# Altium schematic sheet 08_MCU.SchDoc
size 420 x 297 mm; SheetNumber: 16; SheetTotal: 24
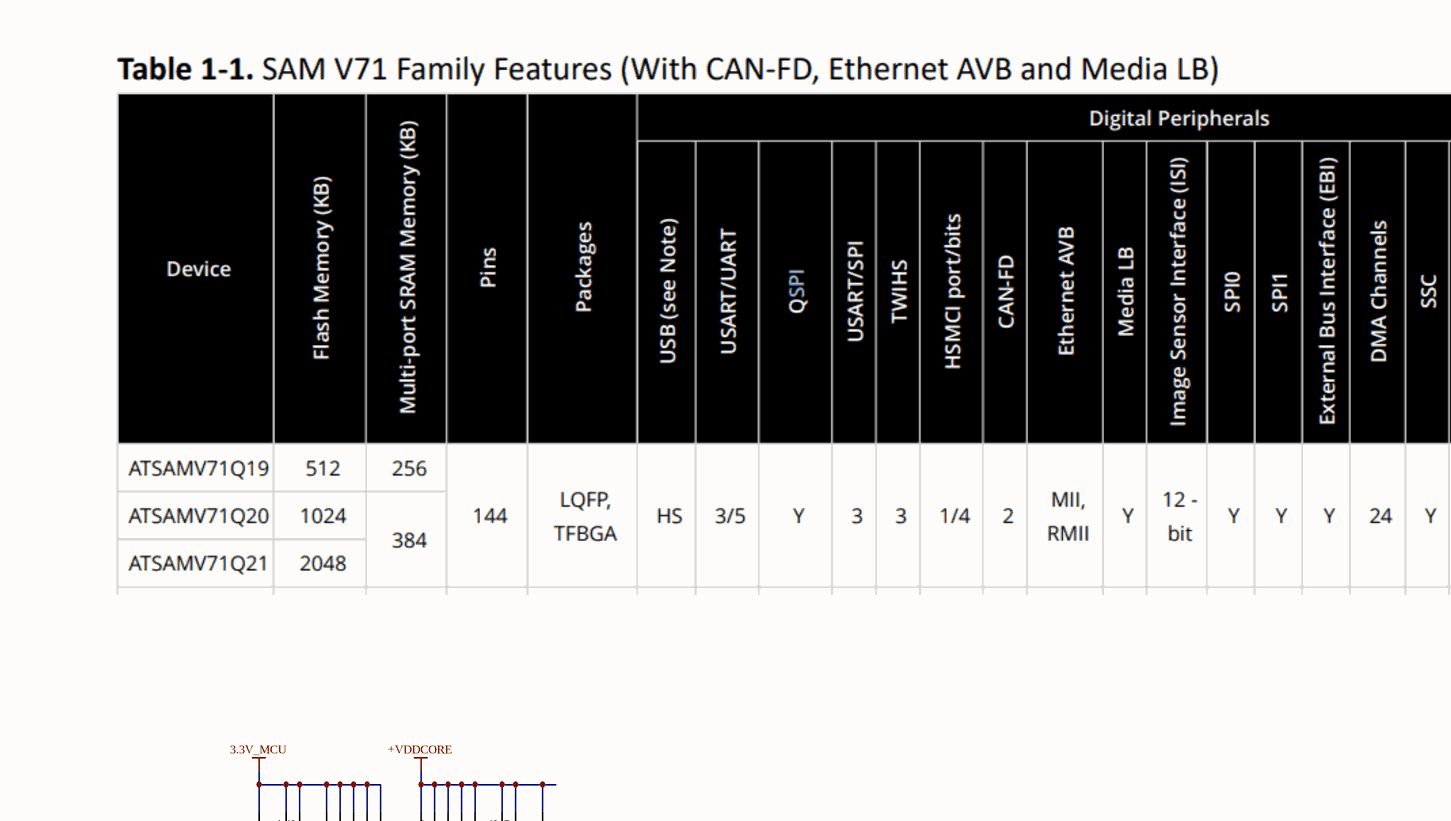
[diagram p0: 08_MCU.SchDoc, top left]
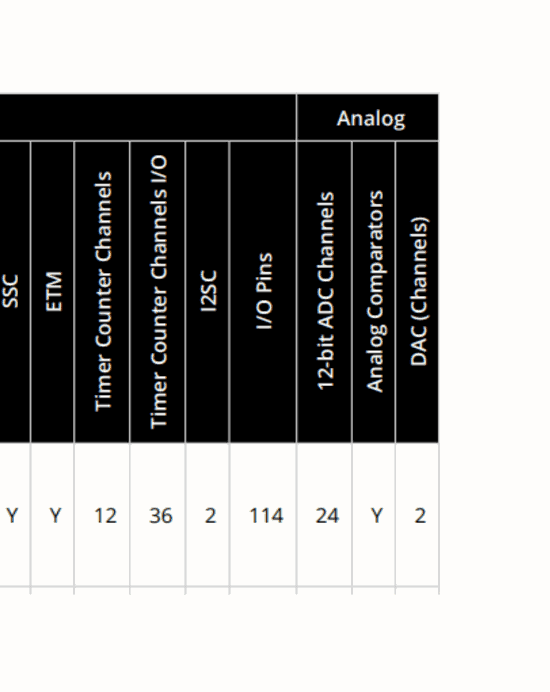
[diagram p1: 08_MCU.SchDoc, top right]
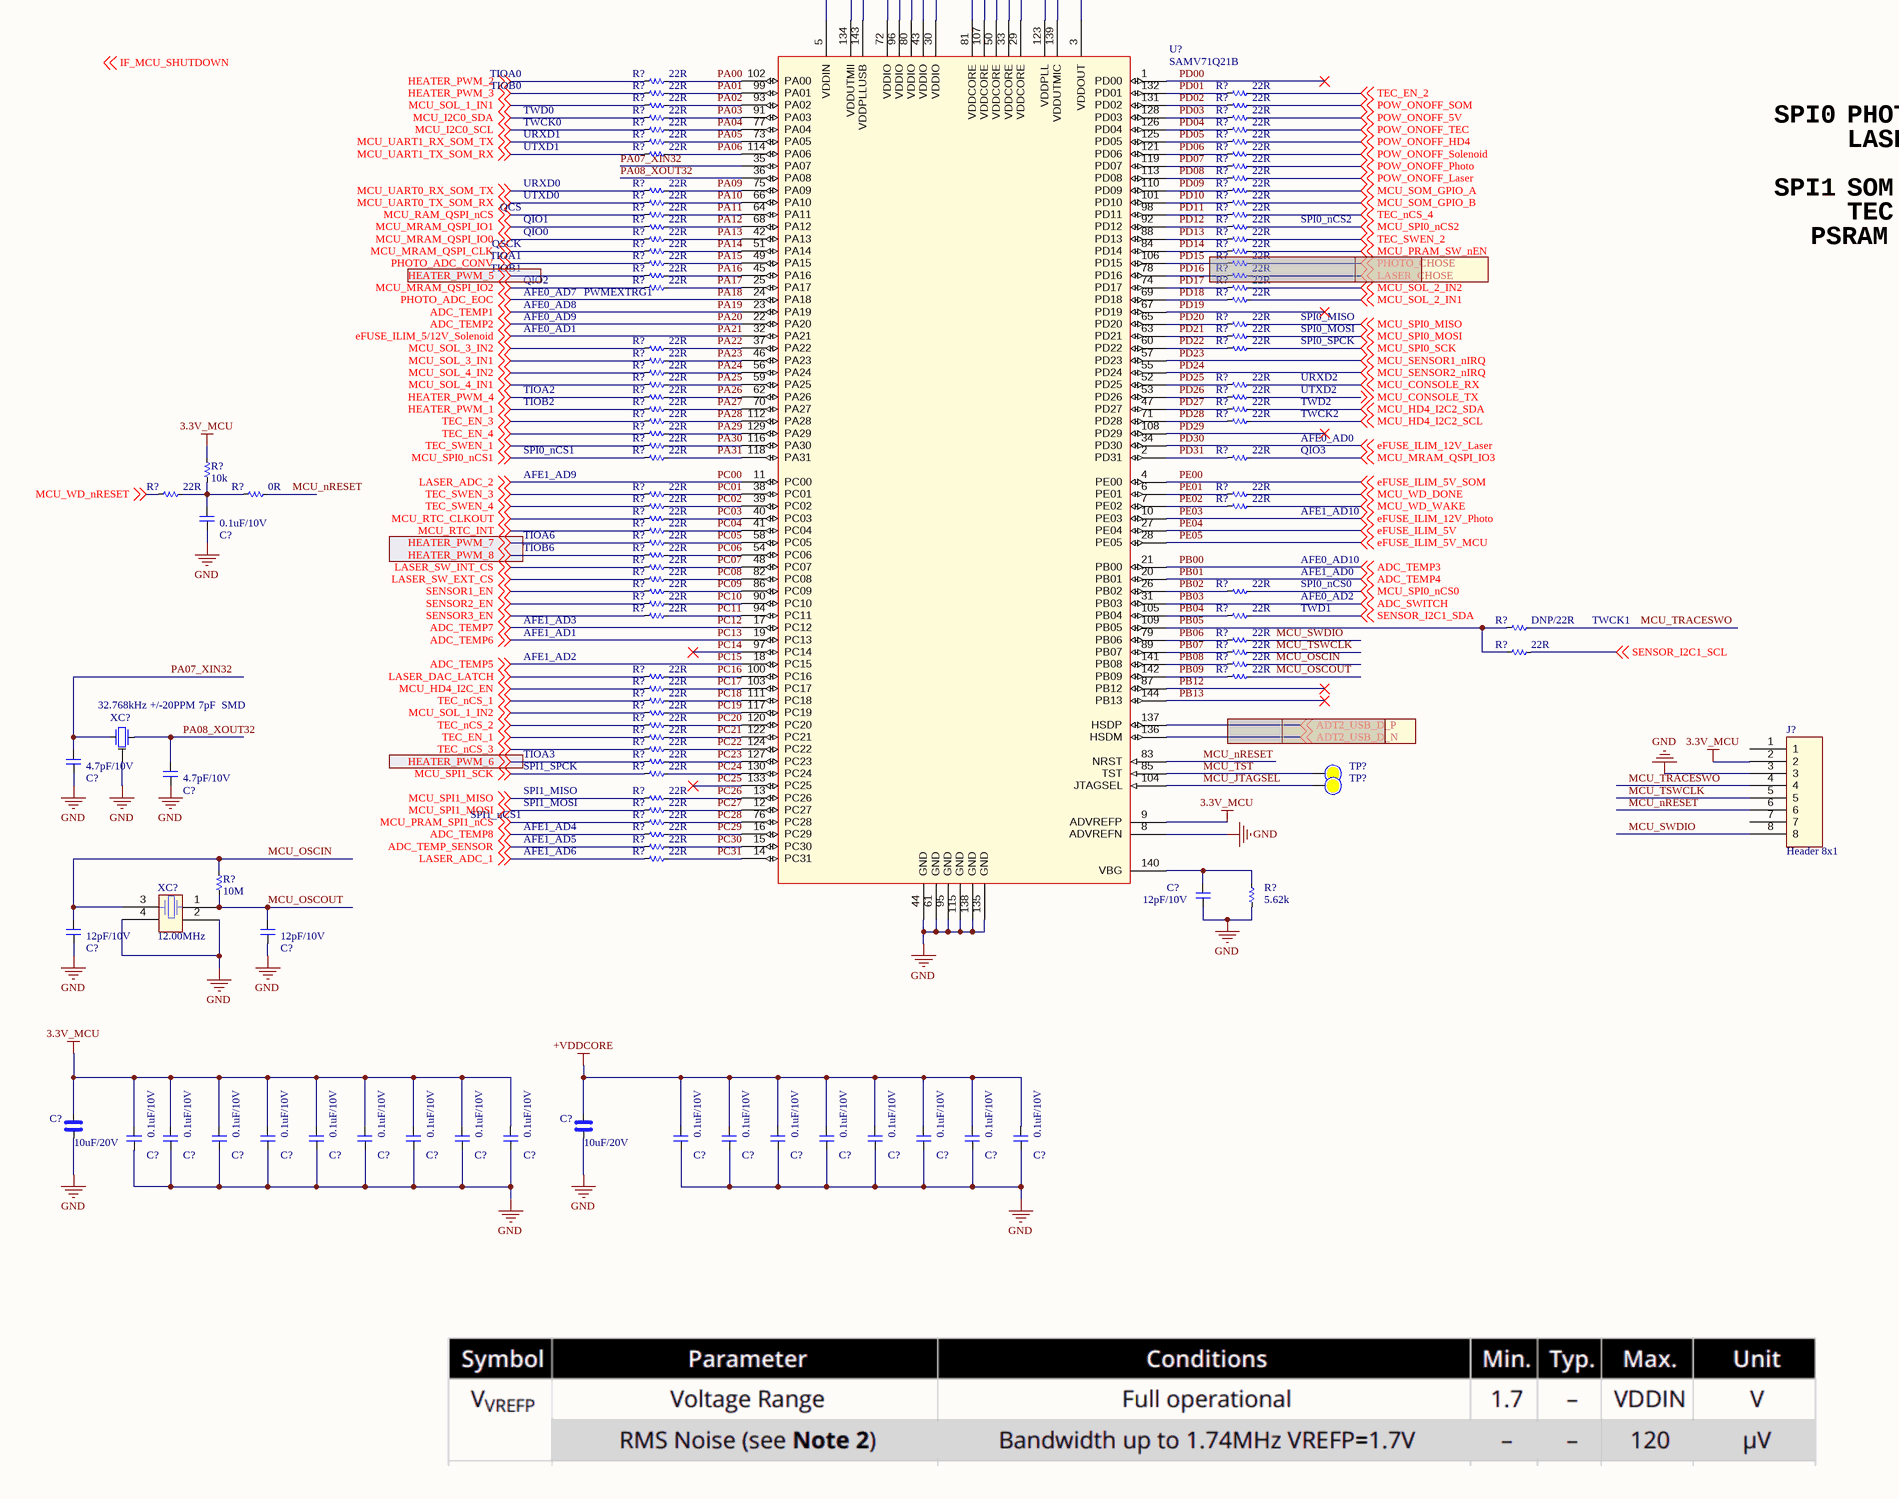
[diagram p2: 08_MCU.SchDoc, bottom left]

## Parts
(Parts that share a designator on the sheet are numbered #1, #2 ... from top to bottom, then left to right.)
C?#1  0.1uF/10V  [CAP_C_1005X60]
C?#2  4.7pF/10V  [CAP_C_1005X60]
C?#3  4.7pF/10V  [CAP_C_1005X60]
C?#4  12pF/10V  [CAP_C_1005X60]
C?#5  12pF/10V  [CAP_C_1005X60]
C?#6  12pF/10V  [CAP_C_1005X60]
C?#7  10uF/20V  [CAP_C_2012X110]
C?#8  10uF/20V  [CAP_C_2012X110]
C?#9  0.1uF/10V  [CAP_C_1005X60]
C?#10  0.1uF/10V  [CAP_C_1005X60]
C?#11  0.1uF/10V  [CAP_C_1005X60]
C?#12  0.1uF/10V  [CAP_C_1005X60]
C?#13  0.1uF/10V  [CAP_C_1005X60]
C?#14  0.1uF/10V  [CAP_C_1005X60]
C?#15  0.1uF/10V  [CAP_C_1005X60]
C?#16  0.1uF/10V  [CAP_C_1005X60]
C?#17  0.1uF/10V  [CAP_C_1005X60]
C?#18  0.1uF/10V  [CAP_C_1005X60]
C?#19  0.1uF/10V  [CAP_C_1005X60]
C?#20  0.1uF/10V  [CAP_C_1005X60]
C?#21  0.1uF/10V  [CAP_C_1005X60]
C?#22  0.1uF/10V  [CAP_C_1005X60]
C?#23  0.1uF/10V  [CAP_C_1005X60]
C?#24  0.1uF/10V  [CAP_C_1005X60]
C?#25  0.1uF/10V  [CAP_C_1005X60]
J?  Header 8x1  [Header_254P_8x1]
R?#1  22R  [RES_C_1005X40]
R?#2  22R  [RES_C_1005X40]
R?#3  22R  [RES_C_1005X40]
R?#4  22R  [RES_C_1005X40]
R?#5  22R  [RES_C_1005X40]
R?#6  22R  [RES_C_1005X40]
R?#7  22R  [RES_C_1005X40]
R?#8  22R  [RES_C_1005X40]
R?#9  22R  [RES_C_1005X40]
R?#10  22R  [RES_C_1005X40]
R?#11  22R  [RES_C_1005X40]
R?#12  22R  [RES_C_1005X40]
R?#13  22R  [RES_C_1005X40]
R?#14  22R  [RES_C_1005X40]
R?#15  22R  [RES_C_1005X40]
R?#16  22R  [RES_C_1005X40]
R?#17  22R  [RES_C_1005X40]
R?#18  22R  [RES_C_1005X40]
R?#19  22R  [RES_C_1005X40]
R?#20  22R  [RES_C_1005X40]
R?#21  22R  [RES_C_1005X40]
R?#22  22R  [RES_C_1005X40]
R?#23  22R  [RES_C_1005X40]
R?#24  22R  [RES_C_1005X40]
R?#25  22R  [RES_C_1005X40]
R?#26  22R  [RES_C_1005X40]
R?#27  22R  [RES_C_1005X40]
R?#28  22R  [RES_C_1005X40]
R?#29  22R  [RES_C_1005X40]  (masked out: inside a compile mask, not in the netlist)
R?#30  22R  [RES_C_1005X40]
R?#31  22R  [RES_C_1005X40]  (masked out: inside a compile mask, not in the netlist)
R?#32  22R  [RES_C_1005X40]
R?#33  22R  [RES_C_1005X40]
R?#34  22R  [RES_C_1005X40]
R?#35  22R  [RES_C_1005X40]
R?#36  22R  [RES_C_1005X40]
R?#37  22R  [RES_C_1005X40]
R?#38  22R  [RES_C_1005X40]
R?#39  22R  [RES_C_1005X40]
R?#40  22R  [RES_C_1005X40]
R?#41  22R  [RES_C_1005X40]
R?#42  22R  [RES_C_1005X40]
R?#43  22R  [RES_C_1005X40]
R?#44  22R  [RES_C_1005X40]
R?#45  22R  [RES_C_1005X40]
R?#46  22R  [RES_C_1005X40]
R?#47  22R  [RES_C_1005X40]
R?#48  22R  [RES_C_1005X40]
R?#49  22R  [RES_C_1005X40]
R?#50  22R  [RES_C_1005X40]
R?#51  22R  [RES_C_1005X40]
R?#52  22R  [RES_C_1005X40]
R?#53  10k  [RES_C_1005X40]
R?#54  22R  [RES_C_1005X40]
R?#55  0R  [RES_C_1005X40]
R?#56  22R  [RES_C_1005X40]
R?#57  22R  [RES_C_1005X40]
R?#58  22R  [RES_C_1005X40]
R?#59  22R  [RES_C_1005X40]
R?#60  22R  [RES_C_1005X40]
R?#61  22R  [RES_C_1005X40]
R?#62  22R  [RES_C_1005X40]
R?#63  22R  [RES_C_1005X40]
R?#64  22R  [RES_C_1005X40]
R?#65  22R  [RES_C_1005X40]
R?#66  22R  [RES_C_1005X40]
R?#67  22R  [RES_C_1005X40]
R?#68  22R  [RES_C_1005X40]
R?#69  22R  [RES_C_1005X40]
R?#70  22R  [RES_C_1005X40]
R?#71  DNP/22R  [RES_C_1005X40]
R?#72  22R  [RES_C_1005X40]
R?#73  22R  [RES_C_1005X40]
R?#74  22R  [RES_C_1005X40]
R?#75  22R  [RES_C_1005X40]
R?#76  22R  [RES_C_1005X40]
R?#77  22R  [RES_C_1005X40]
R?#78  22R  [RES_C_1005X40]
R?#79  22R  [RES_C_1005X40]
R?#80  22R  [RES_C_1005X40]
R?#81  22R  [RES_C_1005X40]
R?#82  22R  [RES_C_1005X40]
R?#83  22R  [RES_C_1005X40]
R?#84  22R  [RES_C_1005X40]
R?#85  22R  [RES_C_1005X40]
R?#86  22R  [RES_C_1005X40]
R?#87  22R  [RES_C_1005X40]
R?#88  22R  [RES_C_1005X40]
R?#89  22R  [RES_C_1005X40]
R?#90  22R  [RES_C_1005X40]
R?#91  22R  [RES_C_1005X40]
R?#92  10M  [RES_C_1005X40]
R?#93  5.62k  [RES_C_1005X40]
TP?#1  (no value)  [Testpoint_TH_D130H80]  (no BOM)
TP?#2  (no value)  [Testpoint_TH_D130H80]  (no BOM)
U?  SAMV71Q21B  [AP6-00118]
XC?#1  value 32.768kHz +/-20PPM 7pF  SMD  [AP7-00044]  (hidden comment: Farnell order no:1539364)
XC?#2  value 12.00MHz  [AP7-00039]

## Nets
3.3V_MCU: C?#7.1 C?#9.2 C?#10.2 C?#11.2 C?#12.2 C?#13.2 C?#14.2 C?#15.2 C?#16.2 C?#17.2 J?.2 R?#53.2 U?.5(VDDIN) U?.9(ADVREFP) U?.30(VDDIO) U?.43(VDDIO) U?.72(VDDIO) U?.80(VDDIO) U?.96(VDDIO) U?.134(VDDUTMII) U?.143(VDDPLLUSB)
+VDDCORE: C?#8.1 C?#18.2 C?#19.2 C?#20.2 C?#21.2 C?#22.2 C?#23.2 C?#24.2 C?#25.2 U?.3(VDDOUT) U?.29(VDDCORE) U?.33(VDDCORE) U?.50(VDDCORE) U?.81(VDDCORE) U?.107(VDDCORE) U?.123(VDDPLL) U?.139(VDDUTMIC)
GND: C?#1.1 C?#2.1 C?#3.1 C?#4.1 C?#5.1 C?#6.1 C?#7.2 C?#8.2 C?#9.1 C?#10.1 C?#11.1 C?#12.1 C?#13.1 C?#14.1 C?#15.1 C?#16.1 C?#17.1 C?#18.1 C?#19.1 C?#20.1 C?#21.1 C?#22.1 C?#23.1 C?#24.1 C?#25.1 J?.3 R?#93.1 U?.8(ADVREFN) U?.44(GND) U?.61(GND) U?.95(GND) U?.115(GND) U?.135(GND) U?.138(GND) XC?#1.3 XC?#2.2 XC?#2.4
ADC_TEMP8: R?#89.2 ; off-sheet ADC_TEMP8
ADC_TEMP_SENSOR: R?#90.2 ; off-sheet ADC_TEMP_SENSOR
HEATER_PWM_1: R?#45.2 ; off-sheet HEATER_PWM_1
HEATER_PWM_2: R?#1.2 ; off-sheet HEATER_PWM_2
HEATER_PWM_3: R?#2.2 ; off-sheet HEATER_PWM_3
HEATER_PWM_4: R?#43.2 ; off-sheet HEATER_PWM_4
HEATER_PWM_5: R?#30.2 ; off-sheet HEATER_PWM_5
HEATER_PWM_6: R?#84.2 ; off-sheet HEATER_PWM_6
HEATER_PWM_7: R?#62.2 ; off-sheet HEATER_PWM_7
HEATER_PWM_8: R?#63.2 ; off-sheet HEATER_PWM_8
LASER_ADC_1: R?#91.2 ; off-sheet LASER_ADC_1
LASER_DAC_LATCH: R?#76.2 ; off-sheet LASER_DAC_LATCH
LASER_SW_EXT_CS: R?#65.2 ; off-sheet LASER_SW_EXT_CS
LASER_SW_INT_CS: R?#64.2 ; off-sheet LASER_SW_INT_CS
MCU_CONSOLE_RX: R?#42.1 ; off-sheet MCU_CONSOLE_RX
MCU_CONSOLE_TX: R?#44.1 ; off-sheet MCU_CONSOLE_TX
MCU_HD4_I2C2_SCL: R?#48.1 ; off-sheet MCU_HD4_I2C2_SCL
MCU_HD4_I2C2_SDA: R?#46.1 ; off-sheet MCU_HD4_I2C2_SDA
MCU_HD4_I2C_EN: R?#78.2 ; off-sheet MCU_HD4_I2C_EN
MCU_I2C0_SCL: R?#8.2 ; off-sheet MCU_I2C0_SCL
MCU_I2C0_SDA: R?#6.2 ; off-sheet MCU_I2C0_SDA
MCU_JTAGSEL: TP?#2.0 U?.104(JTAGSEL)
MCU_MRAM_QSPI_CLK: R?#26.2 ; off-sheet MCU_MRAM_QSPI_CLK
MCU_MRAM_QSPI_IO0: R?#24.2 ; off-sheet MCU_MRAM_QSPI_IO0
MCU_MRAM_QSPI_IO1: R?#22.2 ; off-sheet MCU_MRAM_QSPI_IO1
MCU_MRAM_QSPI_IO2: R?#32.2 ; off-sheet MCU_MRAM_QSPI_IO2
MCU_MRAM_QSPI_IO3: R?#52.1 ; off-sheet MCU_MRAM_QSPI_IO3
MCU_nRESET: J?.6 R?#55.1 U?.83(NRST)
MCU_OSCIN: C?#5.2 R?#75.1 R?#92.2 XC?#2.3
MCU_OSCOUT: C?#6.2 R?#77.1 R?#92.1 XC?#2.1
MCU_PRAM_SPI1_nCS: R?#88.2 ; off-sheet MCU_PRAM_SPI1_nCS
MCU_PRAM_SW_nEN: R?#27.1 ; off-sheet MCU_PRAM_SW_nEN
MCU_RAM_QSPI_nCS: R?#20.2 ; off-sheet MCU_RAM_QSPI_nCS
MCU_RTC_CLKOUT: R?#60.2 ; off-sheet MCU_RTC_CLKOUT
MCU_RTC_INT: R?#61.2 ; off-sheet MCU_RTC_INT
MCU_SOL_1_IN1: R?#4.2 ; off-sheet MCU_SOL_1_IN1
MCU_SOL_1_IN2: R?#80.2 ; off-sheet MCU_SOL_1_IN2
MCU_SOL_2_IN1: R?#34.1 ; off-sheet MCU_SOL_2_IN1
MCU_SOL_2_IN2: R?#33.1 ; off-sheet MCU_SOL_2_IN2
MCU_SOL_3_IN1: R?#39.2 ; off-sheet MCU_SOL_3_IN1
MCU_SOL_3_IN2: R?#37.2 ; off-sheet MCU_SOL_3_IN2
MCU_SOL_4_IN1: R?#41.2 ; off-sheet MCU_SOL_4_IN1
MCU_SOL_4_IN2: R?#40.2 ; off-sheet MCU_SOL_4_IN2
MCU_SOM_GPIO_A: R?#17.1 ; off-sheet MCU_SOM_GPIO_A
MCU_SOM_GPIO_B: R?#19.1 ; off-sheet MCU_SOM_GPIO_B
MCU_SPI0_MISO: R?#35.1 ; off-sheet MCU_SPI0_MISO
MCU_SPI0_MOSI: R?#36.1 ; off-sheet MCU_SPI0_MOSI
MCU_SPI0_nCS0: R?#67.1 ; off-sheet MCU_SPI0_nCS0
MCU_SPI0_nCS1: R?#51.2 ; off-sheet MCU_SPI0_nCS1
MCU_SPI0_nCS2: R?#23.1 ; off-sheet MCU_SPI0_nCS2
MCU_SPI0_SCK: R?#38.1 ; off-sheet MCU_SPI0_SCK
MCU_SPI1_MISO: R?#86.2 ; off-sheet MCU_SPI1_MISO
MCU_SPI1_MOSI: R?#87.2 ; off-sheet MCU_SPI1_MOSI
MCU_SPI1_SCK: R?#85.2 ; off-sheet MCU_SPI1_SCK
MCU_SWDIO: J?.8 R?#72.1
MCU_TRACESWO: J?.4 R?#71.1
MCU_TST: TP?#1.0 U?.85(TST)
MCU_TSWCLK: J?.5 R?#73.1
MCU_UART0_RX_SOM_TX: R?#16.2 ; off-sheet MCU_UART0_RX_SOM_TX
MCU_UART0_TX_SOM_RX: R?#18.2 ; off-sheet MCU_UART0_TX_SOM_RX
MCU_UART1_RX_SOM_TX: R?#10.2 ; off-sheet MCU_UART1_RX_SOM_TX
MCU_UART1_TX_SOM_RX: R?#12.2 ; off-sheet MCU_UART1_TX_SOM_RX
MCU_WD_DONE: R?#57.1 ; off-sheet MCU_WD_DONE
MCU_WD_nRESET: R?#54.2 ; off-sheet MCU_WD_nRESET
MCU_WD_WAKE: R?#59.1 ; off-sheet MCU_WD_WAKE
PA00: R?#1.1 U?.102(PA00)
PA01: R?#2.1 U?.99(PA01)
PA02: R?#4.1 U?.93(PA02)
PA03: R?#6.1 U?.91(PA03)
PA04: R?#8.1 U?.77(PA04)
PA05: R?#10.1 U?.73(PA05)
PA06: R?#12.1 U?.114(PA06)
PA07_XIN32: C?#2.2 U?.35(PA07) XC?#1.1
PA08_XOUT32: C?#3.2 U?.36(PA08) XC?#1.2
PA09: R?#16.1 U?.75(PA09)
PA10: R?#18.1 U?.66(PA10)
PA11: R?#20.1 U?.64(PA11)
PA12: R?#22.1 U?.68(PA12)
PA13: R?#24.1 U?.42(PA13)
PA14: R?#26.1 U?.51(PA14)
PA15: R?#28.1 U?.49(PA15)
PA16: R?#30.1 U?.45(PA16)
PA17: R?#32.1 U?.25(PA17)
PA18: U?.24(PA18) ; off-sheet PHOTO_ADC_EOC  [also labelled PHOTO_ADC_EOC]
PA19: U?.23(PA19) ; off-sheet ADC_TEMP1  [also labelled ADC_TEMP1]
PA20: U?.22(PA20) ; off-sheet ADC_TEMP2  [also labelled ADC_TEMP2]
PA21: U?.32(PA21) ; off-sheet eFUSE_ILIM_5/12V_Solenoid  [also labelled eFUSE_ILIM_5/12V_Solenoid]
PA22: R?#37.1 U?.37(PA22)
PA23: R?#39.1 U?.46(PA23)
PA24: R?#40.1 U?.56(PA24)
PA25: R?#41.1 U?.59(PA25)
PA26: R?#43.1 U?.62(PA26)
PA27: R?#45.1 U?.70(PA27)
PA28: R?#47.1 U?.112(PA28)
PA29: R?#49.1 U?.129(PA29)
PA30: R?#50.1 U?.116(PA30)
PA31: R?#51.1 U?.118(PA31)
PB00: U?.21(PB00) ; off-sheet ADC_TEMP3  [also labelled ADC_TEMP3]
PB01: U?.20(PB01) ; off-sheet ADC_TEMP4  [also labelled ADC_TEMP4]
PB02: R?#67.2 U?.26(PB02)
PB03: U?.31(PB03) ; off-sheet ADC_SWITCH  [also labelled ADC_SWITCH]
PB04: R?#70.2 U?.105(PB04)
PB05: R?#71.2 R?#74.2 U?.109(PB05)
PB06: R?#72.2 U?.79(PB06)
PB07: R?#73.2 U?.89(PB07)
PB08: R?#75.2 U?.141(PB08)
PB09: R?#77.2 U?.142(PB09)
PB12: U?.87(PB12)
PB13: U?.144(PB13)
PC00: U?.11(PC00) ; off-sheet LASER_ADC_2  [also labelled LASER_ADC_2]
PC01: R?#56.1 U?.38(PC01)
PC02: R?#58.1 U?.39(PC02)
PC03: R?#60.1 U?.40(PC03)
PC04: R?#61.1 U?.41(PC04)
PC05: R?#62.1 U?.58(PC05)
PC06: R?#63.1 U?.54(PC06)
PC07: R?#64.1 U?.48(PC07)
PC08: R?#65.1 U?.82(PC08)
PC09: R?#66.1 U?.86(PC09)
PC10: R?#68.1 U?.90(PC10)
PC11: R?#69.1 U?.94(PC11)
PC12: U?.17(PC12) ; off-sheet ADC_TEMP7  [also labelled ADC_TEMP7]
PC13: U?.19(PC13) ; off-sheet ADC_TEMP6  [also labelled ADC_TEMP6]
PC14: U?.97(PC14)
PC15: U?.18(PC15) ; off-sheet ADC_TEMP5  [also labelled ADC_TEMP5]
PC16: R?#76.1 U?.100(PC16)
PC17: R?#78.1 U?.103(PC17)
PC18: R?#79.1 U?.111(PC18)
PC19: R?#80.1 U?.117(PC19)
PC20: R?#81.1 U?.120(PC20)
PC21: R?#82.1 U?.122(PC21)
PC22: R?#83.1 U?.124(PC22)
PC23: R?#84.1 U?.127(PC23)
PC24: R?#85.1 U?.130(PC24)
PC25: U?.133(PC25)
PC26: R?#86.1 U?.13(PC26)
PC27: R?#87.1 U?.12(PC27)
PC28: R?#88.1 U?.76(PC28)
PC29: R?#89.1 U?.16(PC29)
PC30: R?#90.1 U?.15(PC30)
PC31: R?#91.1 U?.14(PC31)
PD00: U?.1(PD00)
PD01: R?#3.2 U?.132(PD01)
PD02: R?#5.2 U?.131(PD02)
PD03: R?#7.2 U?.128(PD03)
PD04: R?#9.2 U?.126(PD04)
PD05: R?#11.2 U?.125(PD05)
PD06: R?#13.2 U?.121(PD06)
PD07: R?#14.2 U?.119(PD07)
PD08: R?#15.2 U?.113(PD08)
PD09: R?#17.2 U?.110(PD09)
PD10: R?#19.2 U?.101(PD10)
PD11: R?#21.2 U?.98(PD11)
PD12: R?#23.2 U?.92(PD12)
PD13: R?#25.2 U?.88(PD13)
PD14: R?#27.2 U?.84(PD14)
PD15: U?.106(PD15)
PD16: U?.78(PD16)
PD17: R?#33.2 U?.74(PD17)
PD18: R?#34.2 U?.69(PD18)
PD19: U?.67(PD19)
PD20: R?#35.2 U?.65(PD20)
PD21: R?#36.2 U?.63(PD21)
PD22: R?#38.2 U?.60(PD22)
PD23: U?.57(PD23) ; off-sheet MCU_SENSOR1_nIRQ  [also labelled MCU_SENSOR1_nIRQ]
PD24: U?.55(PD24) ; off-sheet MCU_SENSOR2_nIRQ  [also labelled MCU_SENSOR2_nIRQ]
PD25: R?#42.2 U?.52(PD25)
PD26: R?#44.2 U?.53(PD26)
PD27: R?#46.2 U?.47(PD27)
PD28: R?#48.2 U?.71(PD28)
PD29: U?.108(PD29)
PD30: U?.34(PD30) ; off-sheet eFUSE_ILIM_12V_Laser  [also labelled eFUSE_ILIM_12V_Laser]
PD31: R?#52.2 U?.2(PD31)
PE00: U?.4(PE00) ; off-sheet eFUSE_ILIM_5V_SOM  [also labelled eFUSE_ILIM_5V_SOM]
PE01: R?#57.2 U?.6(PE01)
PE02: R?#59.2 U?.7(PE02)
PE03: U?.10(PE03) ; off-sheet eFUSE_ILIM_12V_Photo  [also labelled eFUSE_ILIM_12V_Photo]
PE04: U?.27(PE04) ; off-sheet eFUSE_ILIM_5V  [also labelled eFUSE_ILIM_5V]
PE05: U?.28(PE05) ; off-sheet eFUSE_ILIM_5V_MCU  [also labelled eFUSE_ILIM_5V_MCU]
PHOTO_ADC_CONV: R?#28.2 ; off-sheet PHOTO_ADC_CONV
POW_ONOFF_5V: R?#7.1 ; off-sheet POW_ONOFF_5V
POW_ONOFF_HD4: R?#11.1 ; off-sheet POW_ONOFF_HD4
POW_ONOFF_Laser: R?#15.1 ; off-sheet POW_ONOFF_Laser
POW_ONOFF_Photo: R?#14.1 ; off-sheet POW_ONOFF_Photo
POW_ONOFF_Solenoid: R?#13.1 ; off-sheet POW_ONOFF_Solenoid
POW_ONOFF_SOM: R?#5.1 ; off-sheet POW_ONOFF_SOM
POW_ONOFF_TEC: R?#9.1 ; off-sheet POW_ONOFF_TEC
SENSOR1_EN: R?#66.2 ; off-sheet SENSOR1_EN
SENSOR2_EN: R?#68.2 ; off-sheet SENSOR2_EN
SENSOR3_EN: R?#69.2 ; off-sheet SENSOR3_EN
SENSOR_I2C1_SCL: R?#74.1 ; off-sheet SENSOR_I2C1_SCL
SENSOR_I2C1_SDA: R?#70.1 ; off-sheet SENSOR_I2C1_SDA
TEC_EN_1: R?#82.2 ; off-sheet TEC_EN_1
TEC_EN_2: R?#3.1 ; off-sheet TEC_EN_2
TEC_EN_3: R?#47.2 ; off-sheet TEC_EN_3
TEC_EN_4: R?#49.2 ; off-sheet TEC_EN_4
TEC_nCS_1: R?#79.2 ; off-sheet TEC_nCS_1
TEC_nCS_2: R?#81.2 ; off-sheet TEC_nCS_2
TEC_nCS_3: R?#83.2 ; off-sheet TEC_nCS_3
TEC_nCS_4: R?#21.1 ; off-sheet TEC_nCS_4
TEC_SWEN_1: R?#50.2 ; off-sheet TEC_SWEN_1
TEC_SWEN_2: R?#25.1 ; off-sheet TEC_SWEN_2
TEC_SWEN_3: R?#56.2 ; off-sheet TEC_SWEN_3
TEC_SWEN_4: R?#58.2 ; off-sheet TEC_SWEN_4
NetC?#1_2: C?#1.2 R?#53.1 R?#54.1 R?#55.2
NetC?#4_2: C?#4.2 R?#93.2 U?.140(VBG)

Not connected (* = marked no-connect by the designer): J? 1 7; U? 136(HSDM) 137(HSDP)

## Notes on the sheet
- TIOA0
- TIOB0
- URXD1
- UTXD1
- TWD0
- TWCK0
- SPI0
- PHOTO
- LASER
- URXD0
- UTXD0
- QCS
- SPI1
- SOM
- QIO1
- QSCK
- QIO0
- TIOA1
- TIOB1
- SPI0_nCS2
- PSRAM (SOM)
- TEC
- QIO2
- AFE0_AD1
- AFE0_AD8
- AFE0_AD9
- AFE0_AD7
- (near R?#32) PWMEXTRG1
- SPI0_MISO
- SPI0_MOSI
- TIOA2
- SPI0_SPCK
- URXD2
- UTXD2
- SPI0_nCS1
- TIOB2
- QIO3
- AFE0_AD0
- TWD2
- TWCK2
- AFE1_AD9
- AFE1_AD10
- TIOA6
- TIOB6
- AFE0_AD10
- AFE1_AD0
- AFE1_AD1
- AFE1_AD3
- AFE0_AD2
- SPI0_nCS0
- TWD1
- TWCK1
- AFE1_AD2
- TIOA3
- SPI1_nCS1
- SPI1_MISO
- SPI1_MOSI
- SPI1_SPCK
- AFE1_AD4
- AFE1_AD5
- AFE1_AD6
- Labels drawn without touching a wire or pin: IF_MCU_SHUTDOWN
- Project:
- BEE-PC1
- Sub-system:
- NANORACK_EXP_CONTROLLER
- Design by:
- SANG HUYNH
- BAO BUI Q.
- Sheet title:
- Sheet
- A3
- of
- Checked by:
- Approved by:
- VU PHAM
- Revision:
- Document No:
- V1.2.2
- Size:
- Date:

## Library data of the parts
C?#1-C?#6 C?#9-C?#25 = _CAP_C_2: CAP CHIP
C?#7 C?#8 = _CAP_C_High_2: CAP CHIP High Value
R?#1-R?#93 = _RES_B_2: RES
TP?#1 TP?#2 = Test Point: Solder: NF
U? = A06-1541: SAM 32-bit ARM Cortex-M* RISC MCU, SAMV71B Series, QFP144; PartGroup: Integrated Circuits,MCU, MPU, DSP,ARM MCU; Manufacturer: MICROCHIP; MPN: ATSAMV71Q21B-AAB; TemperatureRange: -40Â°C to +105Â°C; AN: A06-1541; Value: SAMV71Q21B; Height: 1,60000002384186
XC?#1 = A07-0052: 32k768 crystal, +-20ppm, CL=7pF, max ESR 60kOhm, SMD; PartGroup: Frequency devices,Crystals,SMD; Manufacturer: Micro Crystal; MPN: MS1V-T1K 32.768kHz 7pF +/-20PPM TA; Tolerance: +/- 20 PPM; TemperatureRange: -40 /+85; AN: A07-0052; Height: 2,07999992370605
XC?#2 = A07-0042: Fox FQ5032B 12.0MHz SMD crystal 738B-12; PartGroup: Frequency devices,Crystals,SMD; Manufacturer: Fox  Electronics; MPN: FQ5032B-12.000; Tolerance: Â±30ppm; TemperatureRange: 0Â°C ~ 70Â°C; AN: A07-0042; Height: 1,20000004768372